# Altium schematic sheet Guide_laser.SchDoc
size 420 x 297 mm; Address1: Address1; Address2: Address2; Address3: Address3; Address4: Address4; DocumentNumber: *Э3; SheetNumber: 3; SheetTotal: 12; DocumentType: Схема электрическая *
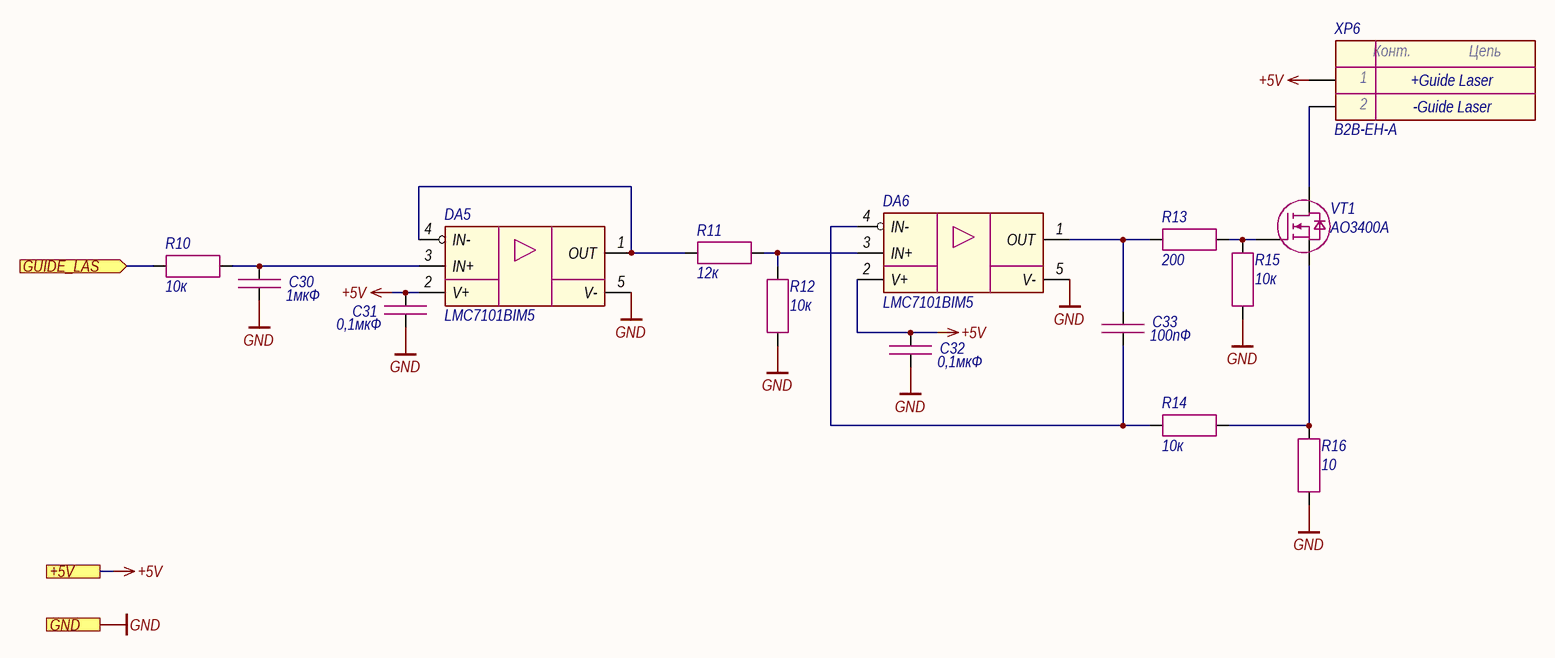
[diagram p0: Guide_laser.SchDoc]

## Parts
C30  1мкФ  [CAP_0603]
C31  0,1мкФ  [CAP_0603]
C32  0,1мкФ  [CAP_0603]
C33  100пФ  [CAP_0603]
DA5  LMC7101BIM5  [SOT-23-5]
DA6  LMC7101BIM5  [SOT-23-5]
R10  10к  [RES_0603]
R11  12к  [RES_0603]
R12  10к  [RES_0603]
R13  200  [RES_0603]
R14  10к  [RES_0603]
R15  10к  [RES_0603]
R16  10  [RES_1210]
VT1  AO3400A  [SOT-23-3]
XP6  B2B-EH-A  [B2B-EH-A]

## Ports
+5V (see Main[2A]), GND (see Main[2A], Bus[1D], Button[1D], Column[1C], Ethernet[3D], Fiber_interlock[2C], Flow_sensor[2C], Hardwiring[3D], Indication[1C]), GUIDE_LAS (in, see Main[3A])

## Nets
+5V: C31.1 C32.1 DA5.2(V+) DA6.2(V+) XP6.1 ; port +5V
GND: C30.2 C31.2 C32.2 DA5.5(V-) DA6.5(V-) R12.2 R15.1 R16.1 ; port GND
GUIDE_LAS: R10.1 ; port GUIDE_LAS
NetC30_1: C30.1 DA5.3(IN+) R10.2
NetC33_1: C33.1 DA6.1(OUT) R13.1
NetC33_2: C33.2 DA6.4(IN-) R14.1
NetDA5_1: DA5.1(OUT) DA5.4(IN-) R11.1
NetDA6_3: DA6.3(IN+) R11.2 R12.1
NetR13_2: R13.2 R15.2 VT1.1(G)
NetR14_2: R14.2 R16.2 VT1.2(S)
NetVT1_3: VT1.3(D) XP6.2

## Notes on the sheet
- +Guide Laser
- -Guide Laser
- Подп. и дата
- Инв. № дубл.
- Взам. инв. №
- Инв. № подл.
- Изм.
- Лист
- № докум.
- Подп.
- Дата
- Копировал
- Формат А3
- (in symbol Connector-2) Конт.; Цепь

## Library data of the parts
C30 = Capacitor: Manufacturer: Murata; Model: GRM188R61H105KAALD; Value: 1мкФ; Document: *
C31 C32 = Capacitor: Manufacturer: Murata; Model: GRM188R71H104KA93D; Value: 0,1мкФ; Document: *
C33 = Capacitor: Manufacturer: Murata; Model: GRM1885C1H101JA01D; Value: 100пФ; Document: *
DA5 DA6 = LMC7101: Manufacturer: Texas Instruments; Model: LMC7101BIM5; Document: *
R10 R12 R14 R15 = Resistor: Manufacturer: Yageo; Model: RC0603FR-0710KL; Value: 10к; Document: *
R11 = Resistor: Manufacturer: Yageo; Model: RC0603FR-0712KL; Value: 12к; Document: *
R13 = Resistor: Manufacturer: Yageo; Model: RC0603FR-07200RL; Value: 200; Document: *
R16 = Resistor: Manufacturer: Yageo; Model: RC1210FR-0710RL; Value: 10; Document: *
VT1 = MOSFET N-channel: Manufacturer: UMW; Model: AO3400A; Document: *
XP6 = Connector-2: Manufacturer: JST; Model: B2B-EH-A; Document: *